# EAGLE design tortilla (EAGLE 5.11)
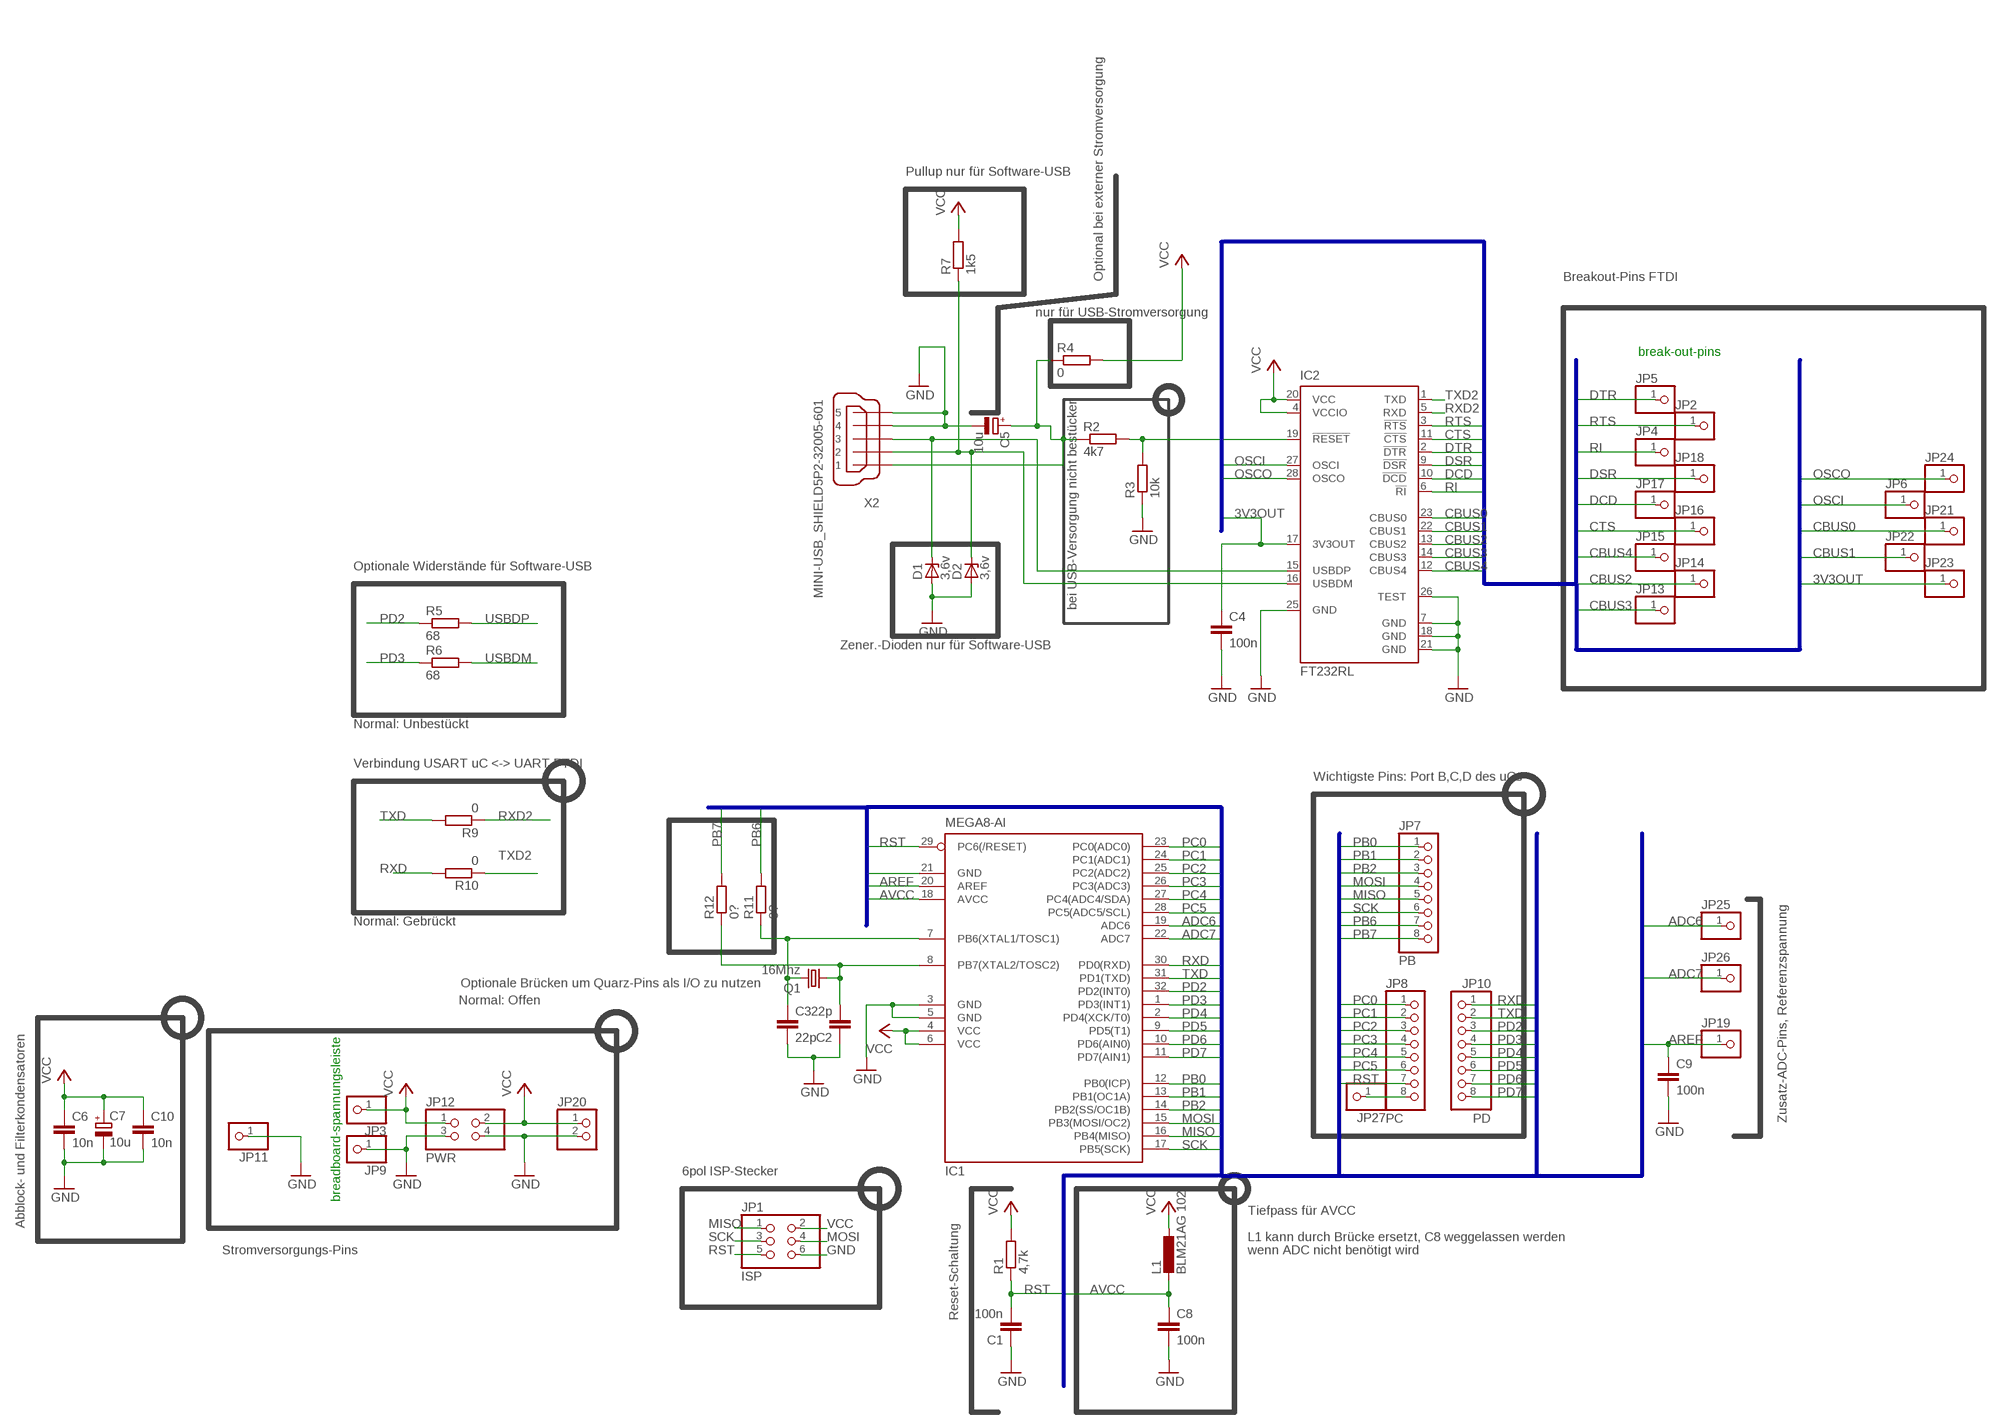
[diagram p0: schematic, sheet 1]

## Parts
C1  100n  C-EUC0805  [C0805]
C2  22p  C-EUC0805  [C0805]
C3  22p  C-EUC0805  [C0805]
C4  100n  C-EUC0805  [C0805]
C5  10u  CPOL-EU153CLV-0405  [153CLV-0405]
C6  10n  C-EUC0805  [C0805]
C7  10u  CPOL-EU153CLV-0405  [153CLV-0405]
C8  100n  C-EUC0805  [C0805]
C9  100n  C-EUC0805  [C0805]
C10  10n  C-EUC0805  [C0805]
D1  3,6v  ZENER-DIODESOT23  [SOT23]
D2  3,6v  ZENER-DIODESOT23  [SOT23]
IC1  MEGA8-AI  [TQFP32-08]
IC2  FT232RL  [SSOP28]
JP1  ISP  PINHD-2X3  [2X03]
JP2  PINHD1-NOPLACE  [1X1-NOPLACE]
JP3  PINHD1-NOPLACE  [1X1-NOPLACE]
JP4  PINHD1-NOPLACE  [1X1-NOPLACE]
JP5  PINHD1-NOPLACE  [1X1-NOPLACE]
JP6  PINHD1-NOPLACE  [1X1-NOPLACE]
JP7  PB  PINHD-1X8  [1X08]
JP8  PC  PINHD-1X8  [1X08]
JP9  PINHD1-NOPLACE  [1X1-NOPLACE]
JP10  PD  PINHD-1X8  [1X08]
JP11  PINHD1-NOPLACE  [1X1-NOPLACE]
JP12  PWR  PINHD-2X2  [2X02]
JP13  PINHD1-NOPLACE  [1X1-NOPLACE]
JP14  PINHD1-NOPLACE  [1X1-NOPLACE]
JP15  PINHD1-NOPLACE  [1X1-NOPLACE]
JP16  PINHD1-NOPLACE  [1X1-NOPLACE]
JP17  PINHD1-NOPLACE  [1X1-NOPLACE]
JP18  PINHD1-NOPLACE  [1X1-NOPLACE]
JP19  PINHD1-NOPLACE  [1X1-NOPLACE]
JP20  PINHD-1X2  [1X02]
JP21  PINHD1-NOPLACE  [1X1-NOPLACE]
JP22  PINHD1-NOPLACE  [1X1-NOPLACE]
JP23  PINHD1-NOPLACE  [1X1-NOPLACE]
JP24  PINHD1-NOPLACE  [1X1-NOPLACE]
JP25  PINHD1-NOPLACE  [1X1-NOPLACE]
JP26  PINHD1-NOPLACE  [1X1-NOPLACE]
JP27  PINHD1-NOPLACE  [1X1-NOPLACE]
L1  BLM21AG 102  L-EUL0805  [L0805]
Q1  16Mhz  CRYSTALHC49UP  [HC49UP]
R1  4,7k  R-EU_R0805  [R0805]
R2  4k7  R-EU_R0805  [R0805]
R3  10k  R-EU_R0805  [R0805]
R4  0  R-EU_R0805  [R0805]
R5  68  R-EU_R0805  [R0805]
R6  68  R-EU_R0805  [R0805]
R7  1k5  R-EU_R0805  [R0805]
R9  0  R-EU_R0603  [R0603]
R10  0  R-EU_R0603  [R0603]
R11  0?  R-EU_R0603  [R0603]
R12  0?  R-EU_R0603  [R0603]
X2  MINI-USB_SHIELD5P2-32005-601  [32005-601]

## Nets
3V3OUT: C4.1 IC2.17(3V3OUT) JP23.1
ADC6: IC1.19(ADC6) JP25.1
ADC7: IC1.22(ADC7) JP26.1
AREF: C9.1 IC1.20(AREF) JP19.1
AVCC: C8.1 IC1.18(AVCC) L1.2
CBUS0: IC2.23(CBUS0) JP21.1
CBUS1: IC2.22(CBUS1) JP22.1
CBUS2: IC2.13(CBUS2) JP14.1
CBUS3: IC2.14(CBUS3) JP13.1
CBUS4: IC2.12(CBUS4) JP15.1
CTS: IC2.11(!CTS) JP16.1
DCD: IC2.10(!DCD) JP17.1
DSR: IC2.9(!DSR) JP18.1
DTR: IC2.2(!DTR) JP5.1
GND: C1.1 C2.1 C3.2 C4.2 C5.- C6.2 C7.- C8.2 C9.2 C10.2 D1.1(A) D2.1(A) IC1.3(GND) IC1.5(GND) IC1.21(GND) IC2.7(GND) IC2.18(GND) IC2.21(GND) IC2.25(GND) IC2.26(TEST) JP1.6 JP9.1 JP11.1 JP12.3 JP12.4 JP20.2 R3.1 X2.4 X2.5
MISO: IC1.16(PB4(MISO)) JP1.1 JP7.5
MOSI: IC1.15(PB3(MOSI/OC2)) JP1.4 JP7.4
N$1: C2.2 IC1.8(PB7(XTAL2/TOSC2)) Q1.1 R12.1
N$2: C3.1 IC1.7(PB6(XTAL1/TOSC1)) Q1.2 R11.1
N$3: JP8.8 JP27.1
N$4: IC2.19(!RESET) R2.2 R3.2
OSCI: IC2.27(OSCI) JP6.1
OSCO: IC2.28(OSCO) JP24.1
PB0: IC1.12(PB0(ICP)) JP7.1
PB1: IC1.13(PB1(OC1A)) JP7.2
PB2: IC1.14(PB2(SS/OC1B)) JP7.3
PB6: JP7.7 R11.2
PB7: JP7.8 R12.2
PC0: IC1.23(PC0(ADC0)) JP8.1
PC1: IC1.24(PC1(ADC1)) JP8.2
PC2: IC1.25(PC2(ADC2)) JP8.3
PC3: IC1.26(PC3(ADC3)) JP8.4
PC4: IC1.27(PC4(ADC4/SDA)) JP8.5
PC5: IC1.28(PC5(ADC5/SCL)) JP8.6
PD2: IC1.32(PD2(INT0)) JP10.3 R5.1
PD3: IC1.1(PD3(INT1)) JP10.4 R6.1
PD4: IC1.2(PD4(XCK/T0)) JP10.5
PD5: IC1.9(PD5(T1)) JP10.6
PD6: IC1.10(PD6(AIN0)) JP10.7
PD7: IC1.11(PD7(AIN1)) JP10.8
RI: IC2.6(!RI) JP4.1
RST: C1.2 IC1.29(PC6(/RESET)) JP1.5 JP8.7 R1.1
RTS: IC2.3(!RTS) JP2.1
RXD: IC1.30(PD0(RXD)) JP10.1 R10.2
RXD2: IC2.5(RXD) R9.1
SCK: IC1.17(PB5(SCK)) JP1.3 JP7.6
TXD: IC1.31(PD1(TXD)) JP10.2 R9.2
TXD2: IC2.1(TXD) R10.1
USBDM: D2.3(C) IC2.16(USBDM) R6.2 R7.1 X2.2
USBDP: D1.3(C) IC2.15(USBDP) R5.2 X2.3
USBVCC: C5.+ R2.1 R4.1 X2.1
VCC: C6.1 C7.+ C10.1 IC1.4(VCC) IC1.6(VCC) IC2.4(VCCIO) IC2.20(VCC) JP1.2 JP3.1 JP12.1 JP12.2 JP20.1 L1.1 R1.2 R4.2 R7.2
Unconnected: X2.M1(S1) X2.M2(S2)

## Buses
B1:RTS,CTS,DTR,DSR,DCD,RI,CBUS[0..4],OSCI,OSCO,3V3OUT
B2:PC[0..7],PD[0..7],PB[0..7],RXD,TXD,MOSI,MISO,SCK,AREF,AVCC,GND,VCC,ADC6,ADC7,RST

## Notes on the sheet
- Pullup nur für Software-USB
- Optional bei externer Stromversorgung | Breakout-Pins FTDI
- nur für USB-Stromversorgung
- break-out-pins
- Optionale Widerstände für Software-USB
- bei USB-Versorgung nicht bestücken
- Zener.-Dioden nur für Software-USB
- Normal: Unbestückt
- Verbindung USART uC <-> UART FTDI
- Wichtigste Pins: Port B,C,D des uCs
- Normal: Gebrückt
- Optionale Brücken um Quarz-Pins als I/O zu nutzen
- Normal: Offen
- Zusatz-ADC-Pins, Referenzspannung
- 6pol ISP-Stecker
- breadboard-spannungsleiste
- Tiefpass für AVCC
- Abblock- und Filterkondensatoren
- L1 kann durch Brücke ersetzt, C8 weggelassen werden
- Stromversorgungs-Pins | wenn ADC nicht benötigt wird
- Reset-Schaltung

## Library data of the parts
C1-C4 C6 C8-C10 = rcl:C-EU: CAPACITOR, European symbol
C5 C7 = rcl:CPOL-EU: POLARIZED CAPACITOR, European symbol
D1 D2 = diode:ZENER-DIODE: Z-Diode
IC1 = atmel:MEGA8: MICROCONTROLLER 8 Kbytes FLASH, 1 kbytes SRAM, 512 bytes EEPROM, USART, 6-channel 10 bit ADC, 2-channel 8 bit ADC Pin compatible with Atmega48, ATMega88, ATMega168 Source: avr.lbr; MPN: ATMEGA8-16AU; OC_FARNELL: 9171371; OC_NEWARK: 73M8863
IC2 = ftdichip:FT232R: Source: http://www.ftdichip.com/Documents/DataSheets/DS_FT232R_v104.pdf; MPN: FT232RL; OC_FARNELL: 1146032; OC_NEWARK: 91K9918
JP1 = pinhead:PINHD-2X3: PIN HEADER
JP2-JP6 JP9 JP11 JP13-JP19 JP21-JP27 = custom:PINHD1-NOPLACE
JP7 JP8 JP10 = pinhead:PINHD-1X8: PIN HEADER
JP12 = pinhead:PINHD-2X2: PIN HEADER
JP20 = pinhead:PINHD-1X2: PIN HEADER
L1 = rcl:L-EU: INDUCTOR, European symbol
Q1 = crystal:CRYSTAL: CRYSTAL; OC_FARNELL: unknown; OC_NEWARK: unknown
R1-R7 R9-R12 = rcl:R-EU_: RESISTOR, European symbol
X2 = con-cypressindustries-mod:MINI-USB_SHIELD5P2-: MINI USB-B R/A DIP 5pol. Source: www.cypressindustries.com; OC_FARNELL: unknown; OC_NEWARK: unknown

## Board
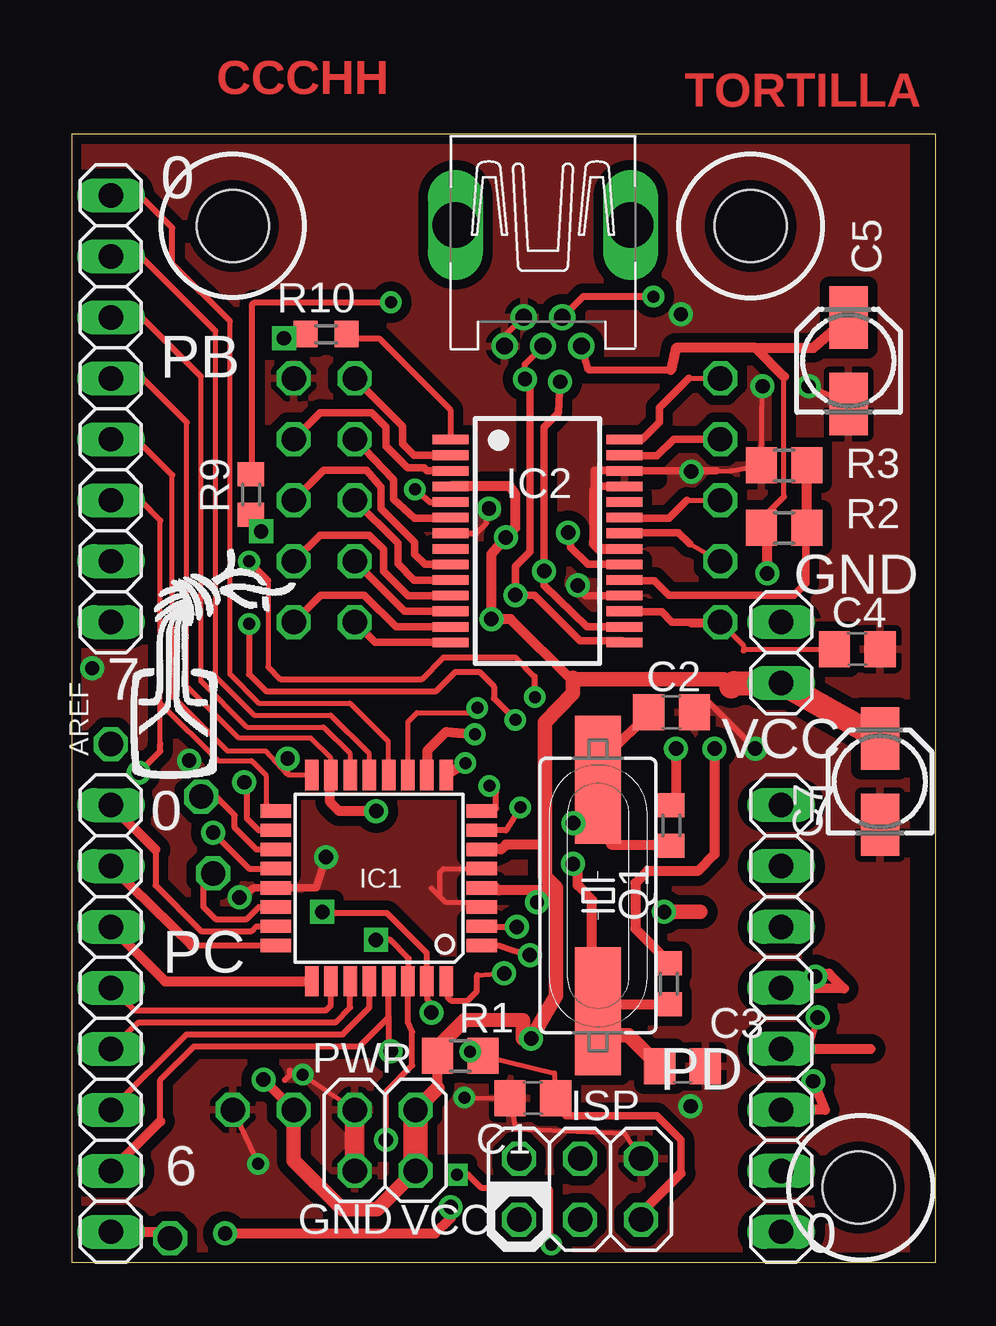
[diagram p1: board, top side]
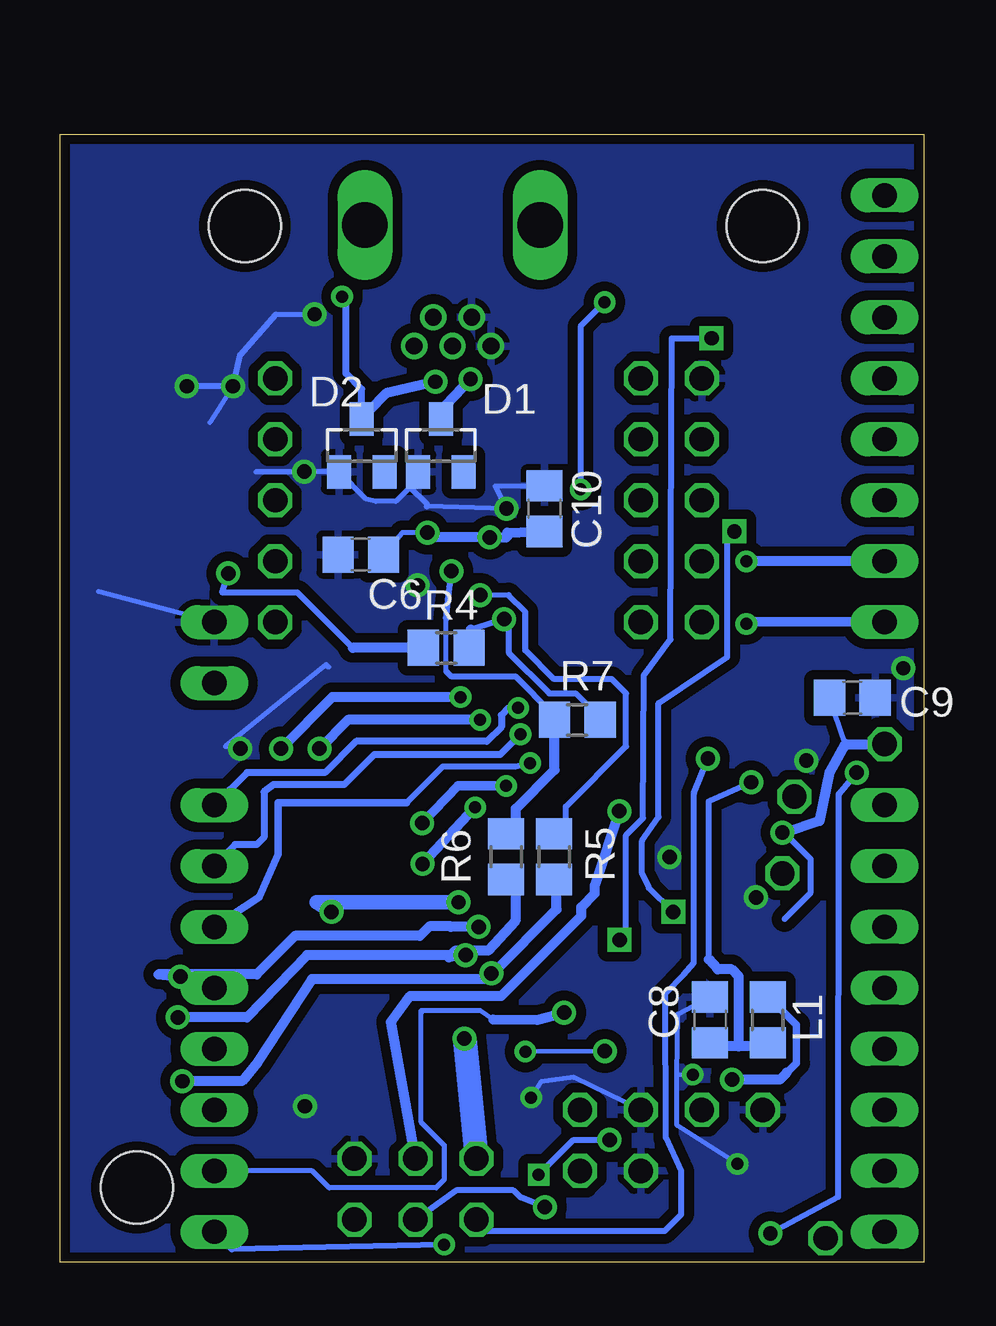
[diagram p2: board, bottom side, seen from below]

Size 36 x 47 mm. Coordinates in mm from the lower left corner, seen from the top.
Outline: 0,0 36,0 36,47 0,47 0,0
Copper layers (1*16): Top 0.035mm / dielectric 1.5mm / Bottom 0.035mm
Design rules "zwilling *": minimum track width 0.2mm, minimum drill 0.5mm, track to track 0.2mm, track to pad 0.2mm, pad to pad 0.15mm, via to via 0.2mm, smd to smd 0mil, copper to edge 0.2mm, drill to drill 0.2mm, minimum pad ring 0.2mm, minimum via ring 0.2mm, stop-mask expansion 0.1mm, vias tented up to drill 25mil, thermal gap 10mil
Holes 3 mm at 32.79,3.11 6.7,43.18 28.29,43.18
tRestrict: area 23.6,32.6 to 24.4,32.7

### Footprints (pad centres in the part's own frame; a part is rotated, then mirrored left to right if it is on the bottom)
C0805 = smd 1.3 x 1.5: 1 -0.95,0; 2 0.95,0
153CLV-0405 = smd 2.6 x 1.6: + 1.8,0; - -1.8,0
SOT23 = smd 1 x 1.4: 1 -0.95,-1.1; 2 0.95,-1.1; 3 0,1.1
TQFP32-08 = smd 1.27 x 0.559: 1 -4.293,2.8; 2 -4.293,2; 3 -4.293,1.2; 4 -4.293,0.4; 5 -4.293,-0.4; 6 -4.293,-1.2; 7 -4.293,-2; 8 -4.293,-2.8; 17 4.293,-2.8; 18 4.293,-2; 19 4.293,-1.2; 20 4.293,-0.4; 21 4.293,0.4; 22 4.293,1.2; 23 4.293,2; 24 4.293,2.8 | smd 0.559 x 1.27: 9 -2.8,-4.293; 10 -2,-4.293; 11 -1.2,-4.293; 12 -0.4,-4.293; 13 0.4,-4.293; 14 1.2,-4.293; 15 2,-4.293; 16 2.8,-4.293; 25 2.8,4.293; 26 2,4.293; 27 1.2,4.293; 28 0.4,4.293; 29 -0.4,4.293; 30 -1.2,4.293; 31 -2,4.293; 32 -2.8,4.293
SSOP28 = smd 0.4 x 1.5: 1 -4.225,-3.625; 2 -3.575,-3.625; 3 -2.925,-3.625; 4 -2.275,-3.625; 5 -1.625,-3.625; 6 -0.975,-3.625; 7 -0.325,-3.625; 8 0.325,-3.625; 9 0.975,-3.625; 10 1.625,-3.625; 11 2.275,-3.625; 12 2.925,-3.625; 13 3.575,-3.625; 14 4.225,-3.625; 15 4.225,3.625; 16 3.575,3.625; 17 2.925,3.625; 18 2.275,3.625; 19 1.625,3.625; 20 0.975,3.625; 21 0.325,3.625; 22 -0.325,3.625; 23 -0.975,3.625; 24 -1.625,3.625; 25 -2.275,3.625; 26 -2.925,3.625; 27 -3.575,3.625; 28 -4.225,3.625
2X03 = drill 1.016 octagon: 1 -2.54,-1.27; 2 -2.54,1.27; 3 0,-1.27; 4 0,1.27; 5 2.54,-1.27; 6 2.54,1.27
1X1-NOPLACE = drill 1.016 octagon: 1 0,0
1X08 = drill 1.016 long: 1 -8.89,0; 2 -6.35,0; 3 -3.81,0; 4 -1.27,0; 5 1.27,0; 6 3.81,0; 7 6.35,0; 8 8.89,0
2X02 = drill 1.016 octagon: 1 -1.27,-1.27; 2 -1.27,1.27; 3 1.27,-1.27; 4 1.27,1.27
1X02 = drill 1.016 long: 1 -1.27,0; 2 1.27,0
L0805 = smd 1.3 x 1.5: 1 -0.95,0; 2 0.95,0
HC49UP = smd 5.334 x 1.93: 1 -4.826,0; 2 4.826,0
R0805 = smd 1.3 x 1.5: 1 -0.95,0; 2 0.95,0
R0603 = smd 1 x 1.1: 1 -0.85,0; 2 0.85,0
32005-601 = drill 0.7 pad 1.016 round: 1 2.825,1.6; 2 1.625,0.8; 3 2.825,0; 4 1.625,-0.8; 5 2.825,-1.6 | drill 1.9 long: M1 -2.225,3.65; M2 -2.225,-3.65

### Placement (x,y rotation side)
C1  19.22,6.84 0 top
C2  24.99,22.91 180 top
C3  25.45,8.17 0 top
C4  32.73,25.55 0 top
C5  32.37,37.56 90 top
C6  23.46,29.49 180 bottom
C7  33.69,20.03 90 top
C8  8.9,10.1 90 bottom
C9  2.97,23.52 0 bottom
C10  15.8,31.4 90 bottom
D1  20.12,34.04 0 bottom
D2  23.42,34.04 0 bottom
IC1  12.8,16 180 top
IC2  19.4,30.05 270 top
JP1  21.18,3.05 0 top
JP2  9.24,34.29 90 top
JP3  9.24,6.35 0 top
JP4  11.78,34.29 0 top
JP5  11.78,36.83 90 top
JP6  27.02,34.29 180 top
JP7  1.62,35.56 270 top
JP8  1.62,10.16 270 top
JP9  6.7,6.35 0 top
JP10  29.56,10.16 90 top
JP11  9.24,36.83 0 top
JP12  13.05,5.08 180 top
JP13  11.78,26.67 90 top
JP14  9.24,26.67 90 top
JP15  11.78,29.21 90 top
JP16  9.24,29.21 90 top
JP17  11.78,31.75 90 top
JP18  9.24,31.75 90 top
JP19  1.62,21.59 0 top
JP20  29.56,25.4 90 top
JP21  27.02,31.75 180 top
JP22  27.02,29.21 180 top
JP23  27.02,26.67 180 top
JP24  27.02,36.83 180 top
JP25  5.38,19.4 0 top
JP26  5.88,16.2 0 top
JP27  4.08,1 0 top
L1  6.5,10.1 270 bottom
Q1  21.93,15.28 270 top
R1  16.18,8.6 180 top
R2  29.68,30.6 0 top
R3  29.68,33.2 0 top
R4  19.9,25.6 0 bottom
R5  15.4,16.9 90 bottom
R6  17.4,16.9 90 bottom
R7  14.43,22.6 0 bottom
R9  7.46,31.99 270 top
R10  10.59,38.67 180 top
R11  24.88,11.6 90 top
R12  24.98,18.2 90 top
X2  19.63,41 270 top

### Tracks (layer width: path | path; a pad name or v marks a point on that pad's centre or on a via)
3V3OUT
  Top 0.2: IC2.17 23.15,27.1 | 25.82,26.6 JP23.1 27.98,25.71 27.98,25.46 28.07,25.55 C4.1
  Top 0.305: JP23.1 25.01,26.67 24.58,27.1 23.15,27.1 | 25.82,26.6 26.48,26.6
ADC6
  Top 0.2: IC1.19
  Top 0.25: IC1.19 7.68,17.2 6.78,18.1 6.78,18.62 6,19.4 JP25.1
ADC7
  Top 0.25: IC1.22 7.78,14.8 7.28,14.3 5.98,14.3 5.48,14.8 5.48,15.8 JP26.1
AREF  (via drill 0.6)
  Top 0.25: IC1.20 7.38,16.4 v5.88,17.9
  Bottom 0.2: 3.26,21.59 C9.1
  Bottom 0.254: v5.88,17.9 5.8,17.9 4.7,16.8 4.7,15.4 5.8,14.3
  Bottom 0.406: JP19.1 3.26,21.59 3.91,20.42 4.33,18.39 5.8,17.9
AVCC  (via drill 0.6)
  Top 0.25: v7.18,20 7.28,19.8 7.28,18.5 7.78,18 IC1.18
  Bottom 0.2: 7.7,9 7.7,9.08
  Bottom 0.254: v7.18,20 8.95,19.2 8.95,12.62
  Bottom 0.406: C8.1 8.9,9 7.7,9 6.5,9 L1.2 | 8.95,12.62 8.58,12.2 8,12.2 7.7,11.9 7.7,9.08
CBUS0
  Top 0.2: 25.63,31.75 JP21.1 | IC2.23 23.05,31
  Top 0.305: 25.63,31.75 24.88,31 23.05,31
CBUS1
  Top 0.2: 25.75,29.93 JP22.1 | IC2.22 23.05,30.4
  Top 0.305: 25.75,29.93 25.28,30.4 23.05,30.4
CBUS2
  Top 0.305: IC2.13 13.51,26.48 12.18,27.8 10.37,27.8 JP14.1
CBUS3
  Top 0.305: IC2.14 12.63,25.82 JP13.1
CBUS4
  Top 0.305: IC2.12 13.87,27.12 JP15.1
CTS
  Top 0.305: IC2.11 14.01,27.77 12.98,28.8 12.98,29.7 12.38,30.3 10.33,30.3 JP16.1
DCD
  Top 0.305: IC2.10 14.26,28.43 13.58,29.1 13.58,29.95 JP17.1
DSR
  Top 0.305: IC2.9 14.71,29.07 14.28,29.5 14.28,30 12.88,31.4 12.88,32.3 12.28,33 10.49,33 JP18.1
DTR
  Top 0.305: IC2.2 14.26,33.62 13.78,34.1 13.78,34.83 JP5.1
GND  (via drill 0.5, 0.6)
  Top 0.2: IC1.5 15.49,16.4 15.34,16.26 15.34,15.24 | 15.34,15.24 15.59,14.99 16.91,14.99 IC1.3 | 15.34,15.24 14.98,15.6 | v28.78,36.5 R3.1 27.48,32.99 v25.81,32.95 26.86,32.98 | C2.1 26.24,23.34 26.54,23.34 | 16.86,30.38 17.28,30.8 17.28,31.1 v17.38,31.4 | 21.41,27.77 21.18,28 | JP9.1 v7.76,4.1 | v9.62,7.82 JP12.3 | v16.36,6.86 C1.1 18.48,5.56 23.04,5.38 JP1.6
  Top 0.254: v30.71,36.5 C5.- | IC2.7 16.86,30.38 | 9.08,8 9.08,7.8 8.88,7.6 | v28.48,21.4 26.54,23.34 | X2.4 18.03,38.58 X2.5
  Top 0.305: 26.86,32.98 IC2.26 22.78,33 21.78,33 21.78,32.3 | 21.41,27.77 IC2.18 | 21.91,32.33 IC2.25 | v6.98,15.2 7.58,15.6 IC1.21 10.18,15.6 v10.59,16.89
  Top 0.406: IC2.21 21.96,29.73 21.78,29.9 21.78,32.2 21.91,32.33
  Top 0.813: JP12.3 JP12.4
  Bottom 0.2: D1.1 21.07,32.63 21.4,32.3 22,31.7 22.84,31.7 23.24,31.8 D2.1 27.84,32.94 v25.81,32.95 | v28.78,36.5 29.75,35 | 27,39.5 v25.38,39.5 | 20.7,31.5 v17.38,31.4 17.85,32.35 C10.2 | 24.8,24.8 24.9,24.9 29.1,21.5 v28.48,21.4 | JP20.2 34.39,27.94 | C8.2 10.24,10.34 10.28,7.83 | 10.28,7.83 10.28,5.7 v7.76,4.1 | 10.28,7.83 v9.62,7.82 | v16.36,6.86 15.94,7.52 14.58,7.7 JP12.3
  Bottom 0.254: 27,39.5 28.5,37.8 v28.78,36.5 v30.71,36.5 | 20.7,31.5 20.7,31.6 21.4,32.3
  other vias: 21.08,28.2 25.78,6.5 0.84,24.75 4.88,20.9
  pour Bottom (isolate 0.406): 35.8,46.7 35.8,0.3 0.4,0.3 0.4,46.7
  pour Top (isolate 0.406): 0.4,46.7 34.78,46.7 34.78,0.3 0.4,0.3
MISO  (via drill 0.6)
  Top 0.2: 2.68,34.3 JP7.5 | 4.18,32.8 4.18,23.6 6.48,21.3 8.08,21.3 8.99,20.32 | 8.99,20.32 9.97,20.32 IC1.16 | v8.99,20.98 8.99,20.32
  Top 0.25: 4.18,32.8 2.68,34.3
  Bottom 0.254: v8.99,20.98 9.57,19.54 9.58,12.47 10,12 10.76,11.2 10.74,5.2 10.1,3.8 10.1,2 10.8,1.3 18.2,1.3 18.6,1.7 19.1,1.7 JP1.1
MOSI  (via drill 0.6)
  Top 0.2: 4.78,35 4.78,24 6.96,21.84 9.95,21.84 10.8,21 IC1.15 10.77,20.26
  Top 0.25: 4.78,35 2.98,36.8 JP7.4
  Top 0.406: 10.77,20.26 10.77,19.17 11.14,18.8 12.58,18.8 v12.68,18.8
  Bottom 0.406: JP1.4 22.2,10.02 21.4,11.1 17.6,11.1 14.27,14.43 14.27,14.8 13.7,15.37 13.7,15.7 v12.68,18.8
N$1  (via drill 0.5, 0.6)
  Top 0.2: Q1.1 22.38,21.2 | IC1.8 17.59,18.8 17.68,18.9 | 17.68,19.6 v17.4,19.85 | 22.12,18.9 21.81,18.58
  Top 0.25: 17.68,18.9 17.68,19.6
  Top 0.254: Q1.1 21.53,19.91 21.81,18.58
  Top 0.406: 22.38,21.2 24.04,22.86 C2.2 | 21.81,18.58 22.48,17.4 24.48,17.4 R12.1 | v20.9,18.3 22.12,18.9
  Bottom 0.4: v20.9,18.3 19.4,19.85 v17.4,19.85
N$2  (via drill 0.5, 0.6)
  Top 0.2: Q1.2 22.2,10.41 22.2,9.46 | 17.12,18.03 IC1.7
  Top 0.25: IC1.7 18.08,18 v18.69,18.95
  Top 0.406: R11.1 21.69,10.74 Q1.2 21.68,10.42 21.68,15.1 21.08,15.7 21.08,16.4 v20.88,16.6
  Top 0.61: C3.1 23.2,9.46 22.2,9.46
  Bottom 0.4: v20.88,16.6 v18.69,18.95
N$3
  Top 0.406: JP8.8 3.81,1.27 JP27.1
N$4
  Top 0.2: 23.05,28.4 IC2.19 | 30.58,30.55 R2.2
  Top 0.305: 23.05,28.4 24.28,28.4 24.88,27.8 30.08,27.8 30.58,28.3 30.58,30.55
  Top 0.406: R2.2 R3.2
OSCI
  Top 0.2: IC2.27 23.05,33.6
  Top 0.305: JP6.1 25.08,34.3 24.38,33.6 23.05,33.6
OSCO
  Top 0.2: 25.71,36.83 JP24.1 | 23.78,34.3 23.1,34.2 IC2.28
  Top 0.305: 25.71,36.83 24.48,35.6 24.48,35 23.78,34.3
PB0
  Top 0.2: 6.58,39.2 6.58,24.5 7.78,23.3 11.58,23.3 13.18,21.7 13.18,20.7 IC1.12
  Top 0.25: 6.58,39.2 4.18,41.6 4.18,43.1 2.88,44.4 JP7.1
PB1
  Top 0.2: 5.98,38.8 5.98,24.4 7.58,22.8 10.78,22.8 12.38,21.2 12.39,20.6 IC1.13
  Top 0.25: 5.98,38.8 2.98,41.8 JP7.2
PB2
  Top 0.2: 5.38,36.9 5.38,24.2 7.28,22.3 10.48,22.3 11.58,21.2 11.58,20.7 IC1.14
  Top 0.25: 5.38,36.9 2.88,39.4 JP7.3
PB6  (via drill 0.5, 0.6)
  Top 0.2: 8.19,28.41 8.19,24.81
  Top 0.254: v19.3,23.55 19.28,24.4 18.48,25.2 15.48,25.2 14.58,24.3 8.68,24.3 8.19,24.81 | v7.38,29.2 8.19,28.41
  Top 0.406: R11.2 24.88,12.5 23.48,13.9 23.48,15.8 23.98,16.3 26.08,16.3 26.78,17 v26.78,21.4
  Bottom 0.406: v26.78,21.4 24.65,23.55 v19.3,23.55 | JP7.7 1.63,29.2 v7.38,29.2
PB7  (via drill 0.5, 0.6)
  Top 0.254: v18.48,22.6 17.58,23.5 17.58,24 16.98,24.6 15.98,24.6 15.18,23.8 8.08,23.8 7.38,24.5 v7.38,26.6
  Top 0.406: R12.2 25.18,19.05 v25.18,21.4
  Bottom 0.254: 7.36,26.7 v7.38,26.6
  Bottom 0.406: v25.18,21.4 24,22.6 v18.48,22.6 | JP7.8 7.36,26.7
PC0
  Top 0.25: IC1.23 7.68,14 7.48,13.8 5.38,13.8 3.48,15.7 3.48,17.19
  Top 0.406: JP8.1 3.48,17.19
PC1
  Top 0.25: 4.98,13.2 IC1.24
  Top 0.406: JP8.2 4.98,13.2
PC2
  Top 0.406: JP8.3 3.88,11.7 9.98,11.7 IC1.25
PC3
  Top 0.25: IC1.26 10.8,10.72 10.58,10.5 2.58,10.5
  Top 0.254: JP8.4 2.58,10.5
PC4
  Top 0.25: IC1.27 11.6,10.62 10.98,10 2.78,10
  Top 0.254: JP8.5 2.78,10
PC5
  Top 0.25: 12.4,10.62 IC1.28 | 4.77,9.5 11.28,9.5
  Top 0.254: 11.28,9.5 12.4,10.62 | JP8.6 4.77,9.5
PD2  (via drill 0.6)
  Top 0.2: 16.89,11.96 v18.02,12.04
  Top 0.25: IC1.32 15.67,11.03 15.81,10.9 16.48,10.9 16.88,11.3 16.89,11.96
  Top 0.406: v30.9,7.54 31.39,6.35 JP10.3
  Bottom 0.406: R5.1 15.3,15.65 15.3,14.7 17.93,12.07 v18.02,12.04 18.2,11.8 25.5,11.8 27.76,8.34 28.42,7.54 v30.9,7.54
PD3  (via drill 0.6)
  Top 0.25: v19.08,12.8 18.4,13 17.78,13.2 IC1.1
  Top 0.254: 33.28,8.9 33.29,8.89 JP10.4 | v31.08,10.2 30.69,8.89
  Top 0.406: 30.69,8.89 33.29,8.89
  Bottom 0.2: 17,15.7 17.15,15.7 R6.1
  Bottom 0.406: v31.08,10.2 28.2,10.2 25.7,12.8 v19.08,12.8 19.8,12.7 19.5,13 18.14,13 17,14.26 17,15.7
PD4  (via drill 0.6)
  Top 0.2: IC1.2 17.12,13.97
  Top 0.25: 17.12,13.97 v18.54,13.97
  Top 0.406: JP10.5 32.18,11.4 31.55,12.03 31.11,12.03 v30.98,11.9
  Bottom 0.406: v18.54,13.97 19.7,13.97 19.7,14 20.6,14 21,13.6 26.2,13.6 27.8,12 31.9,12 v30.98,11.9
PD5  (via drill 0.5)
  Top 0.2: IC1.9 15.62,20.32
  Top 0.406: 15.62,20.32 v16.4,20.8
  Bottom 0.25: v16.4,20.8 17,20.65 20.05,20.65 21.55,19.15
  Bottom 0.305: JP10.6 27.7,15.2 26.9,17 26.9,19.15 21.55,19.15
PD6  (via drill 0.5)
  Top 0.2: IC1.10 14.83,20.33
  Top 0.406: v16.8,22 15.59,22.1 14.83,21.34 14.83,20.33
  Bottom 0.3: JP10.7 28.7,17.4 27.8,17.4 27.5,17.7 27.5,19.6 27.1,19.9 24.15,19.9 22.9,21.15 17.65,21.15 v16.8,22
PD7  (via drill 0.5)
  Top 0.2: v16.9,23.1 16.56,22.9 14.38,22.9 14,22.52 IC1.11
  Bottom 0.3: JP10.8 28.2,20.4 24.95,20.4 23.65,21.7 18.2,21.7 17.6,22.3 17.6,22.8 17.3,23.1 v16.9,23.1
RI
  Top 0.2: JP4.1 11.79,34.29 | 15.75,31 IC2.6
  Top 0.305: 11.79,34.29 13.4,32.6 13.4,31.8 14.28,31 15.75,31
RST  (via drill 0.5, 0.6)
  Top 0.2: 20.72,6.1 C1.2 20.12,7.88 R1.1 v16.6,8.78
  Top 0.25: 13.2,10.22 11.98,9 5.08,9 3.68,7.6 3.68,5.87 | 13.2,10.22 13.2,9.18 v13.28,8.8 | 13.2,10.22 IC1.29
  Top 0.305: 23.72,2.04 JP1.5 | 25.38,3.7 25.38,5.1 24.38,6.1 20.72,6.1 20.58,6.1
  Top 0.406: JP8.7 3.68,5.87 | 25.38,3.7 23.72,2.04
  Bottom 0.2: v13.28,8.8 v16.6,8.78
RTS
  Top 0.305: IC2.3 14.81,32.98 14.68,33.1 13.98,33.1 13.08,34 13.08,34.8 12.48,35.4 10.35,35.4 JP2.1
RXD  (via drill 0.5, 0.6)
  Top 0.25: IC1.30 14,9.98 14.18,9.6 | 14.18,8.2 13.08,7.1 v13.08,5.1
  Top 0.254: 14.18,8.2 14.18,9.6 | R10.2 9,38.67 v8.83,38.5 | v12.67,13.44 13.23,13.45 14.03,12.65 14.03,11.74 IC1.30 | v19.99,0.74 19.92,0.57 19.92,3.04 19.85,3.11 17.05,3.11 16.51,3.65 v16.05,3.65
  Bottom 0.254: v8.83,38.5 10.5,38.5 10.55,25.95 11.66,24.45 11.7,18.51 12.4,17.8 12.4,13.5 v12.67,13.44 | JP10.1 28.83,0.54 v19.99,0.74 | v16.05,3.65 14.59,5.1 v13.08,5.1
RXD2  (via drill 0.5)
  Top 0.254: R9.1 7.5,32.88 7.5,39.9 7.6,40 v13.3,40 | v14.3,32.2 14.92,31.68 IC2.5
  Bottom 0.254: v13.3,40 14.3,39 v14.3,32.2
SCK  (via drill 0.6)
  Top 0.2: 2.88,31.7 JP7.6 | 3.68,23.3 3.68,30.9 | 3.68,23.3 6.08,20.9 7.48,20.9 8.08,20.3 8.08,19.1 8.48,18.8 IC1.17 | 3.68,21.6 3.68,23.3
  Top 0.25: 3.68,30.9 2.88,31.7
  Top 0.254: 3.68,21.6 3.68,21.3 v2.78,20.4
  Top 0.406: v6.38,1.2 15.14,1.2 15.78,1.84 v15.78,2.3
  Bottom 0.254: v6.38,1.2 3.56,2.72 3.54,19.5 v2.78,20.4 | v15.78,2.3 16.8,2.7 17.1,3 19.48,3 JP1.3
TXD  (via drill 0.6)
  Top 0.2: 14.83,11.68 IC1.31
  Top 0.25: 14.83,11.68 14.83,10.92 14.98,10.77 v14.98,10.4
  Top 0.254: IC1.31 14.8,12.88 13.13,14.55 10.48,14.55 v10.43,14.6 | v7.88,30.45 7.88,30.72 R9.2
  Bottom 0.2: JP10.2 25.49,3.81 24.78,3.1 20.32,3.1 19.98,3.44 19.98,4.88 20.94,5.84 20.94,10.38 20.94,10.5 18.48,10.5 17.94,10.12
  Bottom 0.254: v10.43,14.6 11.45,15.6 11.73,16.2 11.73,17.55 11.05,18.55 11.05,23.3 8.18,25.22 8.18,30.22 v7.88,30.45
  Bottom 0.406: 17.94,10.12 16.1,10.1 v14.98,10.4
TXD2
  Top 0.254: R10.1 11.61,38.5 12.8,38.5 15.78,35.52 IC2.1
USBDM  (via drill 0.5, 0.6)
  Top 0.25: v20.35,36.69 20.28,36.7
  Top 0.254: X2.2
  Top 0.3: X2.2 21.31,40.24 v24.24,40.24
  Top 0.305: v20.35,36.69 20.28,35.4 19.68,34.8 v19.68,28.8 19.68,28.2 21.48,26.48 IC2.16
  Bottom 0.2: 23.4,35.46 D2.3 | R7.1 15.38,22.88 | 19.9,24.62 19.9,26.8 | 17,17.8 17.35,17.8 R6.2
  Bottom 0.25: 19.82,27.56 v19.68,28.8
  Bottom 0.254: 19.9,26.8 19.82,27.56 | 15.38,22.88 15.48,22.88 17,24.4 19.68,24.4 19.9,24.62
  Bottom 0.3: v24.24,40.24 24.08,40.08 24.08,37.04 23.42,36.38 D2.3
  Bottom 0.406: v20.35,36.69 22.4,36.2 23.14,35.46 23.4,35.46 | R7.1 15.38,20.52 17,18.9 17,17.8
USBDP  (via drill 0.6)
  Top 0.254: 22.95,25.9 IC2.15 | X2.3 18.88,37.42 v18.88,36.8
  Top 0.305: v18.88,36.8 19.08,36.6 19.08,29.6 18.48,29 v18.48,27.8 19.28,27.8 21.18,25.9 22.95,25.9
  Bottom 0.2: 17.3,27.8 v18.48,27.8
  Bottom 0.254: 17.3,27.8 16.6,27.1 16.6,25.5 15.4,24.3 13,24.3 12.4,23.7 12.4,21.5 14.92,18.98 14.92,17.93 R5.2
  Bottom 0.406: v18.88,36.8 19.9,35.72 D1.3
USBVCC  (via drill 0.6)
  Top 0.2: 29.68,31.9 29.68,36.9 | 28.98,31.15 R2.1
  Top 0.25: 28.98,31.2 29.68,31.9
  Top 0.3: X2.1 21.53,37.18 24.96,37.18
  Top 0.305: 28.98,31.15 28.98,31.2
  Top 0.406: v28.98,28.7 28.98,31.15 | 28.48,38.1 25.18,38.1 24.96,37.18 | 29.68,36.9 28.48,38.1 | 28.48,38.1 30.91,38.1 C5.+
  Bottom 0.254: v28.98,28.7 29.23,27.9 26.1,27.9 23.8,25.6
  Bottom 0.406: R4.1 23.8,25.6
VCC  (via drill 0.6)
  Top 0.2: v7.98,7.61 | R1.2 15.23,8.95 15.43,9.15
  Top 0.254: 19.98,15.6 arc-90 20.18,15.4 19.78,15.4 | IC1.6 17.59,17.2 17.58,17.2
  Top 0.305: IC2.20 21.51,29.07 20.78,29.8 20.78,30.3 v20.68,30.4
  Top 0.406: IC2.4 18.26,32.33 18.48,32 18.48,30.6 v18.08,30.2 17.48,29.5 v17.48,26.8 18.28,26.8 20.88,24.2 | 17.58,17.2 17.88,17.2 18.08,17.4 19.72,17.4 | IC1.4 17.68,15.6 17.78,15.5 19.68,15.5 19.78,15.4 | v7.98,7.61 JP3.1 | 15.23,7.26 R1.2
  Top 0.61: 19.78,15.4 v19.38,15 | v24.68,14.6 26.2,14.6 | 27.48,24 27.18,24.3 20.93,24.3 20.88,24.35 20.88,24.2 20.88,23.7 19.72,22.5 19.72,17.4 19.72,16.06 20.18,15.6 20.18,15.4 20.18,11.1 v19.14,9.32 18.8,9.32 18.8,10.08 16.38,10.1 15.43,9.15 | JP3.1 9.24,4.24 11.28,2.2 12.71,2.2 JP12.2 | JP12.1 15.23,7.26
  Top 1: 27.48,24 27.61,24.13 JP20.1 C7.+
  Top 1.016: JP12.2 JP12.1
  Bottom 0.2: C6.1 21.74,30.4 v20.68,30.4
  Bottom 0.254: 18.9,25.6 18.88,26.36 v17.48,26.8 17.72,26.8 17.3,26.38 17.3,25.4 15.6,23.7 14.5,23.7 13.48,22.68 R7.2
  Bottom 0.305: L1.1 6.45,11.05 5.3,9.9 5.3,8.3 5.7,7.9
  Bottom 0.406: v20.68,30.4 20.7,30.4 20.5,30.2 v18.08,30.2 17.4,30.2 17.35,30.25 17.35,30.4 C10.1 | R4.2 18.88,25.6 18.88,26.36 | 5.7,7.9 5.99,7.61 v7.98,7.61
  Bottom 0.61: v19.38,15 25.3,15 v24.68,14.6
  Bottom 1: v19.14,9.32 JP1.2

### Text on the board
Top: TORTILLA | CCCHH
tPlace: 0 | GND | 7 | AREF | VCC | 0 | 7 | 6 | GND | VCC | 0